# EAGLE design PIR new (EAGLE 9.6.2)
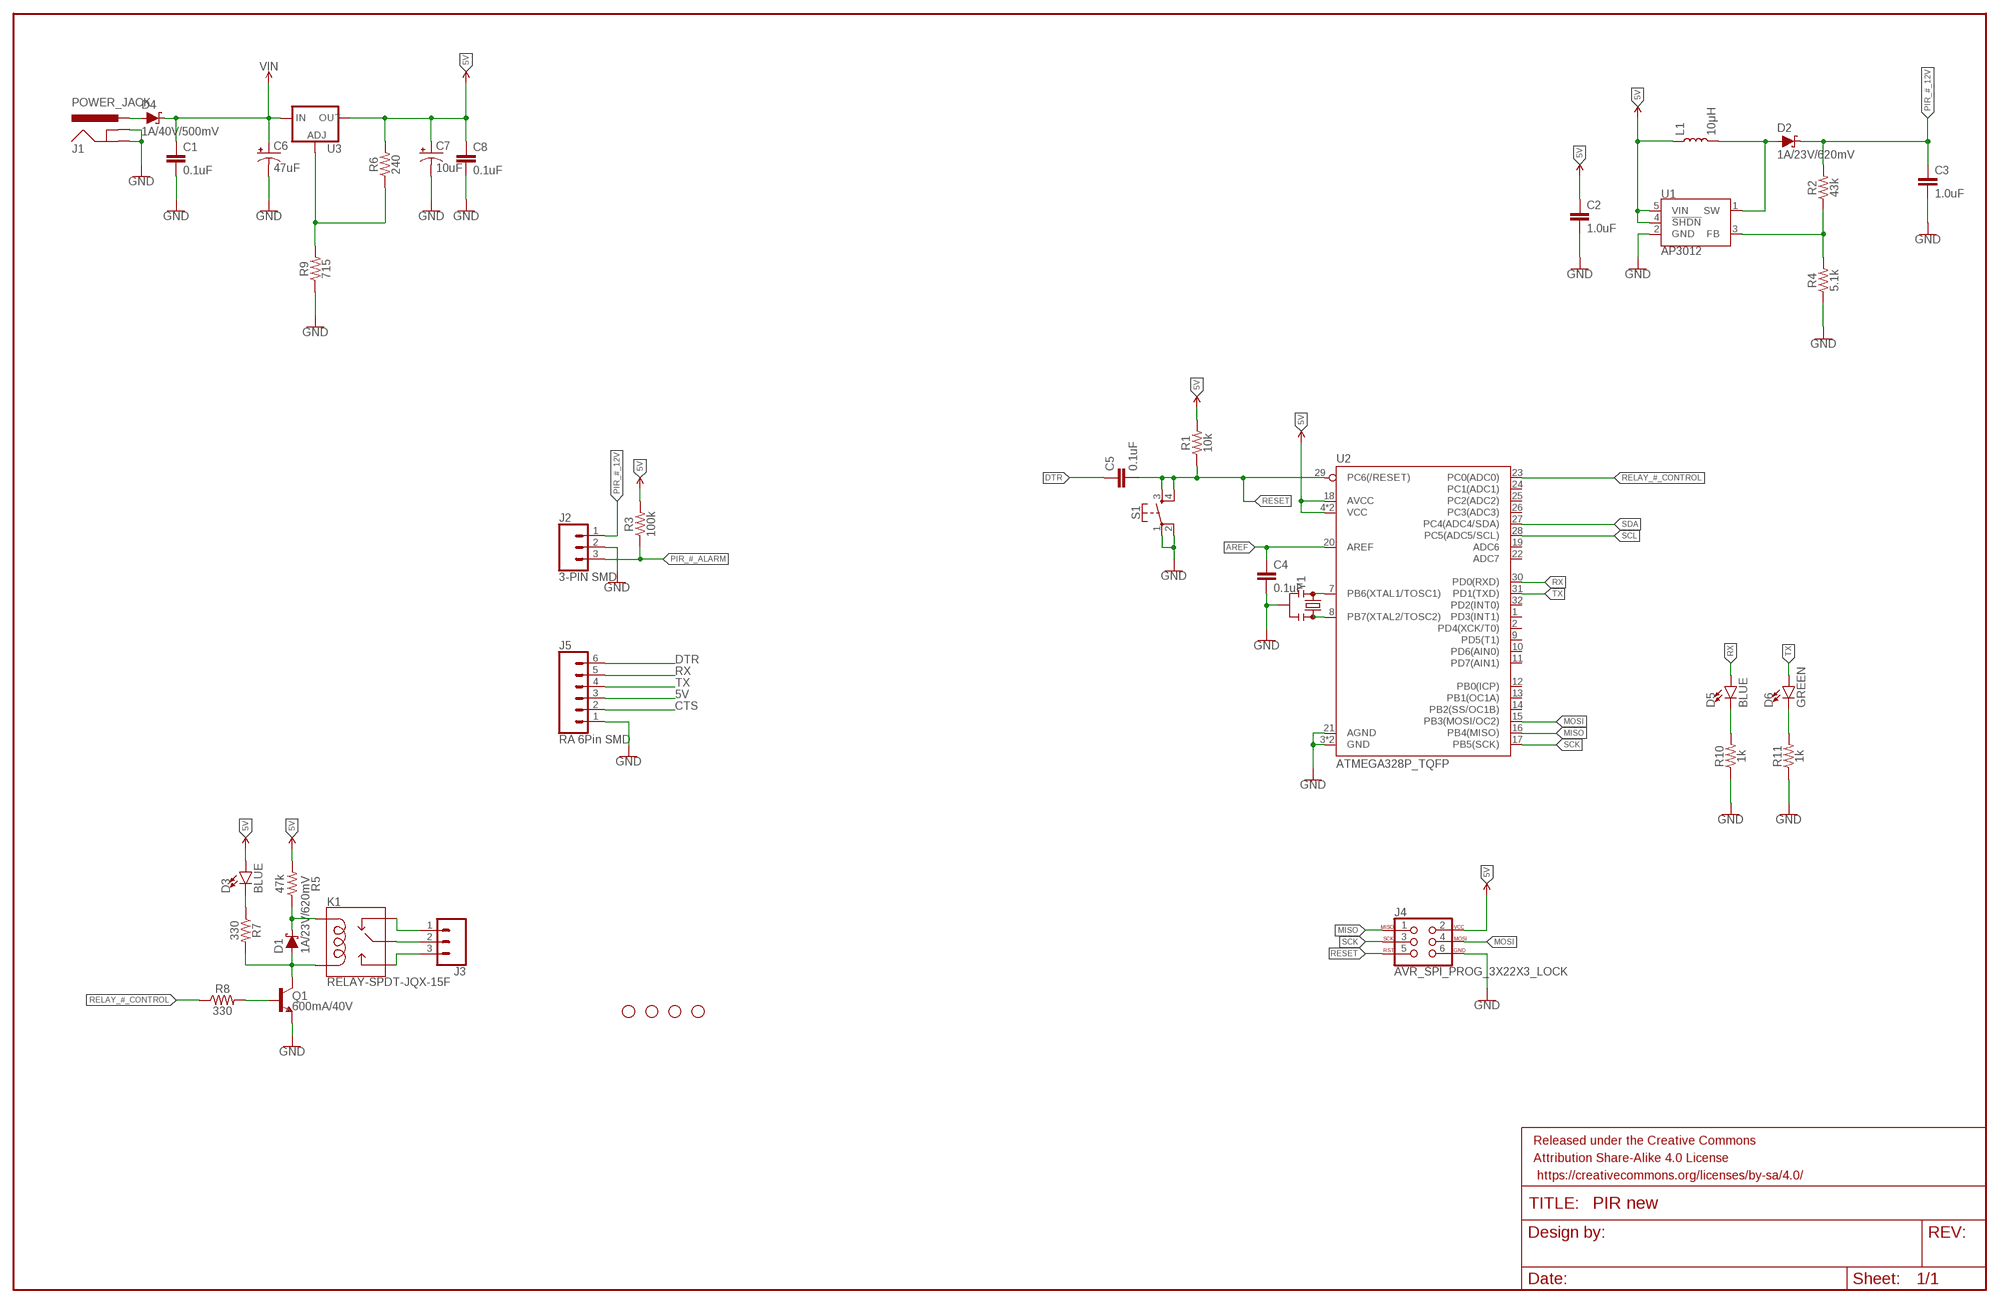
[diagram p0: schematic, sheet 1]

## Parts
C1  0.1uF  0.1UF-0603-25V-5%  [0603]
C2  1.0uF  1.0UF-0603-16V-10%  [0603]
C3  1.0uF  1.0UF-0603-16V-10%  [0603]
C4  0.1uF  0.1UF-0603-25V-(+80/-20%)  [0603]
C5  0.1uF  0.1UF-0603-25V-(+80/-20%)  [0603]
C6  47uF  47UF-POLAR-PANASONIC_D-35V-20%  [PANASONIC_D]
C7  10uF  10UF-POLAR-EIA3216-16V-10%(TANT)  [EIA3216]
C8  0.1uF  0.1UF-0603-25V-(+80/-20%)  [0603]
D1  1A/23V/620mV  DIODE-SCHOTTKY-BAT20J  [SOD-323]
D2  1A/23V/620mV  DIODE-SCHOTTKY-BAT20J  [SOD-323]
D3  BLUE  LED-BLUE0603  [LED-0603]
D4  1A/40V/500mV  DIODE-SCHOTTKY-SS14  [SMA-DIODE]
D5  BLUE  LED-BLUE0603  [LED-0603]
D6  GREEN  LED-GREEN0603  [LED-0603]
FRAME1  FRAME-LEDGER  [CREATIVE_COMMONS]
H1  STAND-OFF  [STAND-OFF]
H2  STAND-OFF  [STAND-OFF]
H3  STAND-OFF  [STAND-OFF]
H4  STAND-OFF  [STAND-OFF]
J1  POWER_JACK  [POWER_JACK_PTH]
J2  3-PIN SMD  CONN_03JST-SMD  [JST-3-SMD]
J3  CONN_03SCREW_LOCK  [SCREWTERMINAL-3.5MM-3_LOCK.007S]
J4  AVR_SPI_PROG_3X22X3_LOCK  [2X3_LOCK]
J5  RA 6Pin SMD  CONN_06SMD  [1X06-SMD_RA_MALE]
K1  RELAY-SPDT-JQX-15F  [RELAY-T90]
L1  10μH  10μH_SHIELDED_INDUCTOR0805  [0805]
Q1  600mA/40V  TRANS_NPN-MMBT2222AL  [SOT23-3]
R1  10k  10KOHM-0603-1/10W-1%  [0603]
R2  43k  43KOHM-0603-1/10W-1%  [0603]
R3  100k  100KOHM-0603-1/10W-1%  [0603]
R4  5.1k  5.1KOHM5.1KOHM-0603-1/10W-1%  [0603]
R5  47k  47KOHM-0603-1/10W-1%  [0603]
R6  240  240OHM-0603-1/10W-1%  [0603]
R7  330  330OHM-0603-1/10W-1%  [0603]
R8  330  330OHM-0603-1/10W-1%  [0603]
R9  715  715OHM-0603-1/10W-1%  [0603]
R10  1k  1KOHM-0603-1/10W-1%  [0603]
R11  1k  1KOHM-0603-1/10W-1%  [0603]
S1  MOMENTARY-SWITCH-SPST-2-SMD-5.2MM-TALL  [TACTILE_SWITCH_SMD_5.2MM]
U1  AP3012  [SOT23-5]
U2  ATMEGA328P_TQFP  [TQFP32-08]
U3  V_REG_LM1117SOT223  [SOT223]
Y1  RESONATORSMD-3.2X1.3  [RESONATOR-SMD-3.2X1.3]

## Nets
5V: C2.1 C7.+ C8.1 D3.A J4.2 J5.3 L1.1 R1.2 R3.2 R5.2 R6.2 U1.4(!SHDN!) U1.5(VIN) U2.4(VCC) U2.6(VCC) U2.18(AVCC) U3.2(OUT) U3.4(OUT) ; supply symbol labelled 3.3V, VCC
AREF: C4.1 U2.20(AREF)
COM: J3.2 K1.MAIN
CTS: J5.2
DTR: C5.1 J5.6
GND: C1.2 C2.2 C3.2 C4.2 C6.- C7.- C8.2 J1.GND J1.GNDBREAK J2.2 J4.6 J5.1 Q1.2(E) R4.1 R9.1 R10.1 R11.1 S1.1 S1.2 U1.2(GND) U2.3(GND) U2.5(GND) U2.21(AGND) Y1.2
MISO: J4.1 U2.16(PB4(MISO))
MOSI: J4.4 U2.15(PB3(MOSI/OC2))
N$1: D2.A L1.2 U1.1(SW)
N$2: D5.C R10.2
N$6: Q1.1(B) R8.2
N$7: D1.A K1.COIL2 Q1.3(C) R7.2
N$8: D1.C K1.COIL1 R5.1
N$9: D3.C R7.1
N$10: U2.7(PB6(XTAL1/TOSC1)) Y1.1
N$11: U2.8(PB7(XTAL2/TOSC2)) Y1.3
N$12: D4.A J1.PWR
N$13: R6.1 R9.2 U3.1(ADJ)
N$14: D6.C R11.2
N$15: R2.1 R4.2 U1.3(FB)
NC: J3.1 K1.NC
NO: J3.3 K1.NO
PIR_#_12V: C3.1 D2.C J2.1 R2.2
PIR_#_ALARM: J2.3 R3.1
RELAY_#_CONTROL: R8.1 U2.23(PC0(ADC0))
RESET: C5.2 J4.5 R1.1 S1.3 S1.4 U2.29(PC6(/RESET))
RX: D5.A J5.5 U2.30(PD0(RXD))
SCK: J4.3 U2.17(PB5(SCK))
SCL: U2.28(PC5(ADC5/SCL))
SDA: U2.27(PC4(ADC4/SDA))
TX: D6.A J5.4 U2.31(PD1(TXD))
VIN: C1.1 C6.+ D4.C U3.3(IN)
Unconnected: U2.1(PD3(INT1)) U2.2(PD4(XCK/T0)) U2.9(PD5(T1)) U2.10(PD6(AIN0)) U2.11(PD7(AIN1)) U2.12(PB0(ICP)) U2.13(PB1(OC1A)) U2.14(PB2(SS/OC1B)) U2.19(ADC6) U2.22(ADC7) U2.24(PC1(ADC1)) U2.25(PC2(ADC2)) U2.26(PC3(ADC3)) U2.32(PD2(INT0))

## Library data of the parts
C1 = SparkFun-Capacitors:0.1UF: 0.1µF ceramic capacitors A capacitor is a passive two-terminal electrical component used to store electrical energy temporarily in an electric field.; PROD_ID: CAP-08604
C2 C3 = SparkFun-Capacitors:1.0UF: 1µF ceramic capacitors A capacitor is a passive two-terminal electrical component used to store electrical energy temporarily in an electric field.; PROD_ID: CAP-00868
C4 C5 C8 = SparkFun-Capacitors:0.1UF: 0.1µF ceramic capacitors A capacitor is a passive two-terminal electrical component used to store electrical energy temporarily in an electric field.; PROD_ID: CAP-00810
C6 = SparkFun-Capacitors:47UF-POLAR: 47µF polarized capacitors A capacitor is a passive two-terminal electrical component used to store electrical energy temporarily in an electric field.; PROD_ID: CAP-08478
C7 = SparkFun-Capacitors:10UF-POLAR: 10.0µF polarized capacitors A capacitor is a passive two-terminal electrical component used to store electrical energy temporarily in an electric field.; PROD_ID: CAP-00811
D1 D2 = SparkFun-DiscreteSemi:DIODE-SCHOTTKY: Schottky diode A Schottky diode is a semiconductor diode which has a low forward voltage drop and a very fast switching action.; PROD_ID: DIO-11623
D3 D5 = SparkFun-LED:LED-BLUE: Blue SMD LED Used in manufacturing of various products at SparkFun Packages: 0603 - SMD 0603 package [Product Link] <http://www.digikey.com/product-detail/en/SMLE12BC7TT86/511-1589-2-ND/1641808> 1206 - SMD1206 package [Product Link] <http://www.digikey.com/product-detail/en/lite-on-inc/LTST-C150TBKT/160-1643-1-ND/573584> SparkFun Products: ESP8266 Thing-Dev Board <https://www.sparkfun.com/products/13711> RedBoard <https://www.sparkfun.com/products/12757>; PROD_ID: DIO-08575
D4 = SparkFun-DiscreteSemi:DIODE-SCHOTTKY: Schottky diode A Schottky diode is a semiconductor diode which has a low forward voltage drop and a very fast switching action.; PROD_ID: DIO-08053
D6 = SparkFun-LED:LED-GREEN: Green SMD LED Used in manufacturing of various products at SparkFun Packages: 0603 - SMD 0603 package [Product Link] <http://www.futureelectronics.com/en/technologies/semiconductors/optoelectronics/leds/Pages/9894312-LTST-C190GKT.aspx?CrossPart=HSMG-C190&IM=0> LilyPad 1206 - SMD1206 LilyPad package [Product Link] <http://www.futureelectronics.com/en/Technologies/Product.aspx?ProductID=IN150NGHARVATEKCORPORATION2049943&IM=0> 1206 - SMD1206 package [Product Link] <http://www.futureelectronics.com/en/technologies/semiconductors/optoelectronics/leds/Pages/8315665-LTST-C150KGKT.aspx?IM=0> 1206 Bottom Mount -SMD 1206 Bottom Mount [Product Link] <http://www.digikey.com/product-detail/en/lite-on-inc/LTST-C230KGKT/160-1456-1-ND/386854> SparkFun Products: Pro Mini 328 -5V <https://www.sparkfun.com/products/821> RedBoard <https://www.sparkfun.com/products/12757> MP3 Trigger <https://www.sparkfun.com/products/13720> Makey Makey <https://www.sparkfun.com/products/11076>; PROD_ID: DIO-00821
FRAME1 = SparkFun-Aesthetics:FRAME-LEDGER: Schematic Frame - Ledger Standard 11x14 US Ledger frame
H1-H4 = SparkFun-Hardware:STAND-OFF: Stand Off Drill holes for mechanically mounting via screws, standoffs, etc. Note: Use the keepout ring to avoid running the screw head into surrounding components. Variant Overviews STAND-OFF - Mechanical footprint for a #4 phillips button head screw. STAND-OFF-TIGHT - Mechanical footprint for a #4 phillips button head screw, Example SparkFun Products Screw - Phillips Head (1/4", 4-40, 10 pack) <https://www.sparkfun.com/products/10453> (PRT-10453) Screw - Phillips Head (1/2", 4-40, 10 pack) <https://www.sparkfun.com/products/10452> (PRT-10452) Screw - Phillips Head (3/4", 4-40, 10 pack) <https://www.sparkfun.com/products/10451> (PRT-10451) Screw - Phillips Head (1", 4-40, 10 pack) <https://www.sparkfun.com/products/10450> (PRT-10450)
J1 = SparkFun-Connectors:POWER_JACK: Power Jack Connector This is the standard 5.5mm barrel jack for power. The PTH is the most common, proven, reliable, footprint. The Slot footprint only works if the mill layer is transmitted to the PCB fab house so be warned. Here are the connectors we sell at SparkFun: DC Barrel Power Jack/Connector <https://www.sparkfun.com/products/119> (PRT-00119) DC Barrel Power Jack/Connector (SMD) <https://www.sparkfun.com/products/12748> (PRT-12748) DC Barrel Jack Adapter - Breadboard Compatible <https://www.sparkfun.com/products/10811> (PRT-10811) It is used on this SparkFun product (and many, many others): SparkFun RedBoard - Programmed with Arduino <https://www.sparkfun.com/products/12757> (DEV-12757) Also, if you need a mating power supply or connector, please check these out: Wall Adapter Power Supply - 9VDC 650mA <https://www.sparkfun.com/products/298> (TOL-00298) DC Barrel Jack Adapter - Male <https://www.sparkfun.com/products/10287> (PRT-10287); PROD_ID: CONN-08197
J2 = SparkFun-Connectors:CONN_03: Multi connection point. Often used as Generic Header-pin footprint for 0.1 inch spaced/style header connections On any of the 0.1 inch spaced packages, you can populate with these: Break Away Headers - Straight <https://www.sparkfun.com/products/116> (PRT-00116) Break Away Male Headers - Right Angle <https://www.sparkfun.com/products/553> (PRT-00553) Female Headers <https://www.sparkfun.com/products/115> (PRT-00115) Break Away Headers - Machine Pin <https://www.sparkfun.com/products/117> (PRT-00117) Break Away Female Headers - Swiss Machine Pin <https://www.sparkfun.com/products/743> (PRT-00743) Stackable Header - 3 Pin (Female, 0.1") <https://www.sparkfun.com/products/13875> (PRT-13875) For SCREWTERMINALS and SPRING TERMINALS visit here: Screw Terimnals on SparkFun.com <https://www.sparkfun.com/search/results?term=Screw+Terminals> (5mm/3.5mm/2.54mm spacing) This device is also useful as a general connection point to wire up your design to another part of your project. Our various solder wires solder well into these plated through hole pads. Hook-Up Wire - Assortment (Stranded, 22 AWG) <https://www.sparkfun.com/products/11375> (PRT-11375) Hook-Up Wire - Assortment (Solid Core, 22 AWG) <https://www.sparkfun.com/products/11367> (PRT-11367) View the entire wire category on our website here <https://www.sparkfun.com/categories/141> Special notes: Molex polarized connector foot print use with SKU : PRT-08232 with associated crimp pins and housings.; PROD_ID: CONN-12591
J3 = SparkFun-Connectors:CONN_03: Multi connection point. Often used as Generic Header-pin footprint for 0.1 inch spaced/style header connections On any of the 0.1 inch spaced packages, you can populate with these: Break Away Headers - Straight <https://www.sparkfun.com/products/116> (PRT-00116) Break Away Male Headers - Right Angle <https://www.sparkfun.com/products/553> (PRT-00553) Female Headers <https://www.sparkfun.com/products/115> (PRT-00115) Break Away Headers - Machine Pin <https://www.sparkfun.com/products/117> (PRT-00117) Break Away Female Headers - Swiss Machine Pin <https://www.sparkfun.com/products/743> (PRT-00743) Stackable Header - 3 Pin (Female, 0.1") <https://www.sparkfun.com/products/13875> (PRT-13875) For SCREWTERMINALS and SPRING TERMINALS visit here: Screw Terimnals on SparkFun.com <https://www.sparkfun.com/search/results?term=Screw+Terminals> (5mm/3.5mm/2.54mm spacing) This device is also useful as a general connection point to wire up your design to another part of your project. Our various solder wires solder well into these plated through hole pads. Hook-Up Wire - Assortment (Stranded, 22 AWG) <https://www.sparkfun.com/products/11375> (PRT-11375) Hook-Up Wire - Assortment (Solid Core, 22 AWG) <https://www.sparkfun.com/products/11367> (PRT-11367) View the entire wire category on our website here <https://www.sparkfun.com/categories/141> Special notes: Molex polarized connector foot print use with SKU : PRT-08232 with associated crimp pins and housings.; PROD_ID: CONN-08288; SF_ID: PRT-08235
J4 = SparkFun-Connectors:AVR_SPI_PROG_3X2: AVR ISP 6 Pin This is the reduced ISP connector for AVR programming. Common on Arduino. This footprint will take up less PCB space and can be used with a 10-pin to 6-pin adapter such as SKU: BOB-08508 **Special note about "TEST_POINT" package. The stop mask is on the top side, so if you want your programming test points to be on the bottom of your board, make sure to place this package on the bottom side of the board. This also ensure that the orientation to program from the bottom side will be correct. SparkFun Products: SparkFun ISP Pogo Adapter <https://www.sparkfun.com/products/11591> - NS Tiny AVR Programmer <https://www.sparkfun.com/products/11801> -PTH
J5 = SparkFun-Connectors:CONN_06: Multi connection point. Often used as Generic Header-pin footprint for 0.1 inch spaced/style header connections On any of the 0.1 inch spaced packages, you can populate with these: Break Away Headers - Straight <https://www.sparkfun.com/products/116> (PRT-00116) Break Away Male Headers - Right Angle <https://www.sparkfun.com/products/553> (PRT-00553) Female Headers <https://www.sparkfun.com/products/115> (PRT-00115) Break Away Headers - Machine Pin <https://www.sparkfun.com/products/117> (PRT-00117) Break Away Female Headers - Swiss Machine Pin <https://www.sparkfun.com/products/743> (PRT-00743) Arduino Stackable Header - 6 Pin <https://www.sparkfun.com/products/9280> (PRT-09280) For SCREWTERMINALS and SPRING TERMINALS visit here: Screw Terimnals on SparkFun.com <https://www.sparkfun.com/search/results?term=Screw+Terminals> (5mm/3.5mm/2.54mm spacing) This device is also useful as a general connection point to wire up your design to another part of your project. Our various solder wires solder well into these plated through hole pads. Hook-Up Wire - Assortment (Stranded, 22 AWG) <https://www.sparkfun.com/products/11375> (PRT-11375) Hook-Up Wire - Assortment (Solid Core, 22 AWG) <https://www.sparkfun.com/products/11367> (PRT-11367) View the entire wire category on our website here <https://www.sparkfun.com/categories/141>; PROD_ID: CONN-08971
K1 = SparkFun-Electromechanical:RELAY-SPDT: SPDT Electromechanical Relay Single-pole, double-throw sealed relays. When current is applied to the coil, it throws a simple changeover switch, terminating the connection from the NC contact to ground and closing the NO contact. Use them to switch high voltage/high current devices. SparkFun Products JQX-15F: Relay SPDT Sealed - 20A <https://www.sparkfun.com/products/10924> (COM-10924) JZC-11F: Relay SPDT Sealed <https://www.sparkfun.com/products/100> (COM-00100); PROD_ID: COMP-10736; SF_SKU: COM-10924
L1 = SparkFun-Coils:10μH_SHIELDED_INDUCTOR: Murata 10uH Inductor 10uH 60mA 400mOhm 0805 Package Shielded; PROD_ID: NDUC-13231
Q1 = SparkFun-DiscreteSemi:TRANS_NPN: NPN transistor Current controlled devices typically used to amplify current or used as a switch. BC547 - COM-08928 <http://www.sparkfun.com/products/8928> (TO-92 45V 100mA) (1.Collector 2.Base 3.Emitter) 2N3904 - COM-00521 <http://www.sparkfun.com/products/521> (TO-92 40V 200mA) (1.Emitter 2.Base 3.Collector) P2N2222A - COM-12852 <http://www.sparkfun.com/products/12852> (TO-92 40V 600mA) (1.Collector 2.Base 3.Emitter); PROD_ID: TRANS-08049
R1 = SparkFun-Resistors:10KOHM: 10kΩ resistor A resistor is a passive two-terminal electrical component that implements electrical resistance as a circuit element. Resistors act to reduce current flow, and, at the same time, act to lower voltage levels within circuits. - Wikipedia; PROD_ID: RES-00824
R2 = SparkFun-Resistors:43KOHM: 43kΩ resistor A resistor is a passive two-terminal electrical component that implements electrical resistance as a circuit element. Resistors act to reduce current flow, and, at the same time, act to lower voltage levels within circuits. - Wikipedia; PROD_ID: RES-07858
R3 = SparkFun-Resistors:100KOHM: 100kΩ resistor A resistor is a passive two-terminal electrical component that implements electrical resistance as a circuit element. Resistors act to reduce current flow, and, at the same time, act to lower voltage levels within circuits. - Wikipedia; PROD_ID: RES-07828
R4 = SparkFun-Resistors:5.1KOHM; PROD_ID: RES-12083
R5 = SparkFun-Resistors:47KOHM: 47kΩ resistor A resistor is a passive two-terminal electrical component that implements electrical resistance as a circuit element. Resistors act to reduce current flow, and, at the same time, act to lower voltage levels within circuits. - Wikipedia; PROD_ID: RES-07871
R6 = SparkFun-Resistors:240OHM: 240Ω resistor A resistor is a passive two-terminal electrical component that implements electrical resistance as a circuit element. Resistors act to reduce current flow, and, at the same time, act to lower voltage levels within circuits. - Wikipedia; PROD_ID: RES-07849
R7 R8 = SparkFun-Resistors:330OHM: 330Ω resistor A resistor is a passive two-terminal electrical component that implements electrical resistance as a circuit element. Resistors act to reduce current flow, and, at the same time, act to lower voltage levels within circuits. - Wikipedia; PROD_ID: RES-00818
R9 = SparkFun-Resistors:715OHM: 715Ω resistor A resistor is a passive two-terminal electrical component that implements electrical resistance as a circuit element. Resistors act to reduce current flow, and, at the same time, act to lower voltage levels within circuits. - Wikipedia; PROD_ID: RES-07850
R10 R11 = SparkFun-Resistors:1KOHM: 1kΩ resistor A resistor is a passive two-terminal electrical component that implements electrical resistance as a circuit element. Resistors act to reduce current flow, and, at the same time, act to lower voltage levels within circuits. - Wikipedia; PROD_ID: RES-07856
S1 = SparkFun-Switches:MOMENTARY-SWITCH-SPST-2: Momentary Switch (Pushbutton) - SPST - Two Circuits Normally-open (NO) SPST momentary switches (buttons, pushbuttons). Schematic symbol includes two switch circuits. Variants SMD-4.6MMX2.8MM - 4.60mm x 2.80mm Tactile Momentary Button Switch - Used on SparkFun SAMD21 Mini Breakout <https://www.sparkfun.com/products/13664> SMD-5.2MM - Mini Pushbutton Switch - SMD <https://www.sparkfun.com/products/8720> - Used on Arduino Pro Mini <https://www.sparkfun.com/products/11114>; PROD_ID: SWCH-14139
U1 = SparkFun-IC-Power:AP3012: AP3012 The AP3012 is a high power, constant frequency, current mode PWM, inductor based, step-up (boost) converter. The converter operates at high frequency (1.5MHz) so that a small, low profile inductor can be used. Datasheet <https://www.diodes.com/assets/Datasheets/AP3012.pdf>; PROD_ID: VREG-13911
U2 = SparkFun-IC-Microcontroller:ATMEGA328P_TQFP: Popular 328P in QFP Storefront component: ATmega328 - TQFP <https://www.sparkfun.com/products/13448> (COM-13448) Datasheet <http://www.sparkfun.com/datasheets/Components/SMD/ATMega328.pdf> SparkFun Products SparkFun RedBoard - Programmed with Arduino <https://www.sparkfun.com/products/12757> (DEV-12757) Arduino Pro Mini 328 - 5V/16MHz <https://www.sparkfun.com/products/11113> (DEV-11113) Arduino Pro Mini 328 - 3.3V/8MHz <https://www.sparkfun.com/products/11114> (DEV-11114) SparkFun OpenLog <https://www.sparkfun.com/products/13712> (DEV-13712) SparkFun MicroView - OLED Arduino Module <https://www.sparkfun.com/products/12923> (DEV-12923) SparkFun Digital Sandbox <https://www.sparkfun.com/products/12651> (DEV-12651) SparkFun PicoBoard <https://www.sparkfun.com/products/11888> (WIG-11888) Arduino Fio <https://www.sparkfun.com/products/10116> (DEV-10116) LilyPad Arduino 328 Main Board <https://www.sparkfun.com/products/13342> (DEV-13342) SparkFun RedStick <https://www.sparkfun.com/products/13741> (DEV-13741) LilyPad MP3 <https://www.sparkfun.com/products/11013> (DEV-11013) LilyPad Arduino SimpleSnap <https://www.sparkfun.com/products/10941> (DEV-10941) SparkFun Stepoko <https://www.sparkfun.com/products/13899> (ROB-13899) SparkFun Geiger Counter <https://www.sparkfun.com/products/11345> (SEN-11345) SparkFun EL Sequencer <https://www.sparkfun.com/products/12781> (COM-12781) Arduino Pro 328 - 5V/16MHz <https://www.sparkfun.com/products/10915> (DEV-10915) CryptoCape <https://www.sparkfun.com/products/12773> (DEV-12773) SparkFun IR Thermometer Evaluation Board - MLX90614 <https://www.sparkfun.com/products/10740> (SEN-10740) SparkFun RedBot Mainboard <https://www.sparkfun.com/products/12097> (ROB-12097) Arduino Pro 328 - 3.3V/8MHz <https://www.sparkfun.com/products/10914> (DEV-10914) SparkFun Block for Intel® Edison - Arduino <https://www.sparkfun.com/products/13036> (DEV-13036) SparkFun Simon Says - Surface Mount Soldering Kit <https://www.sparkfun.com/products/10935> (KIT-10935) SparkFun 7-Segment Serial Display - Red <https://www.sparkfun.com/products/11441> (COM-11441) SparkFun 7-Segment Serial Display - White <https://www.sparkfun.com/products/11629> (COM-11629) SparkFun 7-Segment Serial Display - Yellow <https://www.sparkfun.com/products/11443> (COM-11443) SparkFun 7-Segment Serial Display - Kelly Green <https://www.sparkfun.com/products/11440> (COM-11440) SparkFun 7-Segment Serial Display - Blue <https://www.sparkfun.com/products/11442> (COM-11442) SparkFun OpenSegment Serial Display - 20mm (Blue) <https://www.sparkfun.com/products/11647> (COM-11647) SparkFun OpenSegment Serial Display - 20mm (Green) <https://www.sparkfun.com/products/11646> (COM-11646) SparkFun OpenSegment Serial Display - 20mm (White) <https://www.sparkfun.com/products/11648> (COM-11648) SparkFun OpenSegment Serial Display - 20mm (Red) <https://www.sparkfun.com/products/11644> (COM-11644) SparkFun OpenSegment Serial Display - 20mm (Yellow) <https://www.sparkfun.com/products/11645> (COM-11645) SparkFun OpenSegment Shield <https://www.sparkfun.com/products/13190> (DEV-13190); PROD_ID: IC-09069
U3 = SparkFun-IC-Power:V_REG_LM1117: Voltage Regulator LM1117 Standard adjustable voltage regulator but in SMD form. Spark Fun Electronics SKU : COM-00595; PROD_ID: VREG-08170
Y1 = SparkFun-Clocks:RESONATOR: Resonators (Generic) Ceramic resonators are clock-generating components, often used to control timing in microcontrollers. They usually have 3 pins: two pins for oscillation, and one pin for ground. Compared to crystals, resonators have worse tolerance, but are usually much cheaper. Plus, they have built-in load capacitors! These devices are used on boards like the Arduino Pro 8MHz <https://www.sparkfun.com/products/11114> and Arduino Pro 16MHz <https://www.sparkfun.com/products/11113>.

## Board
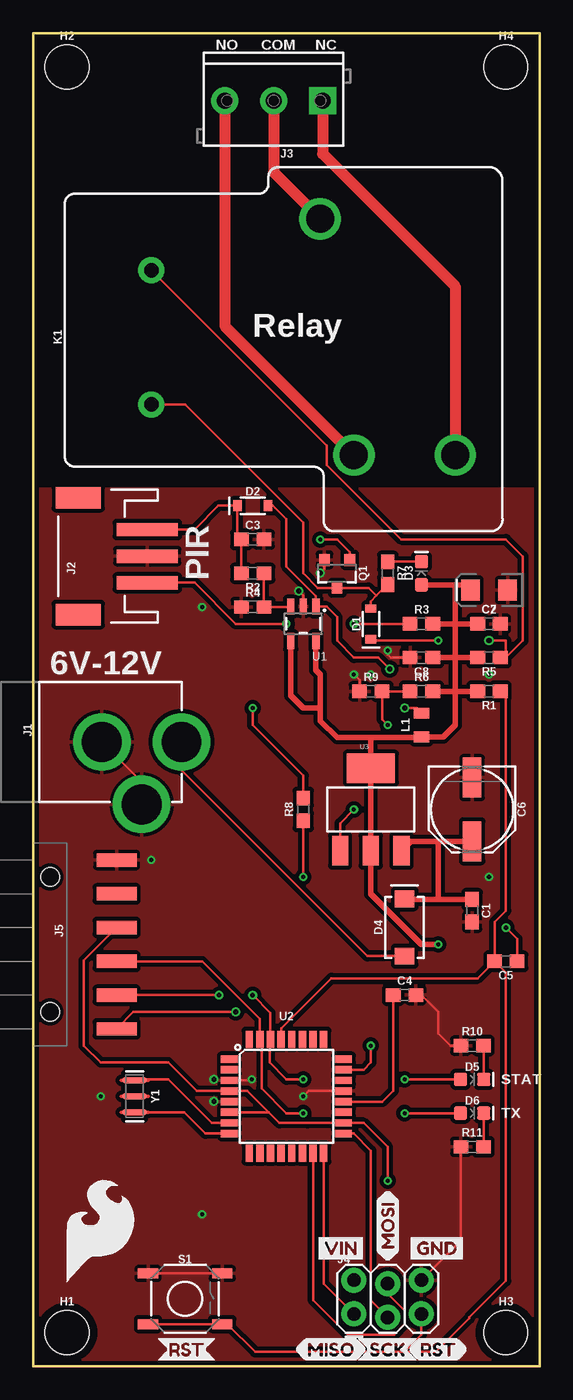
[diagram p1: board, top side]
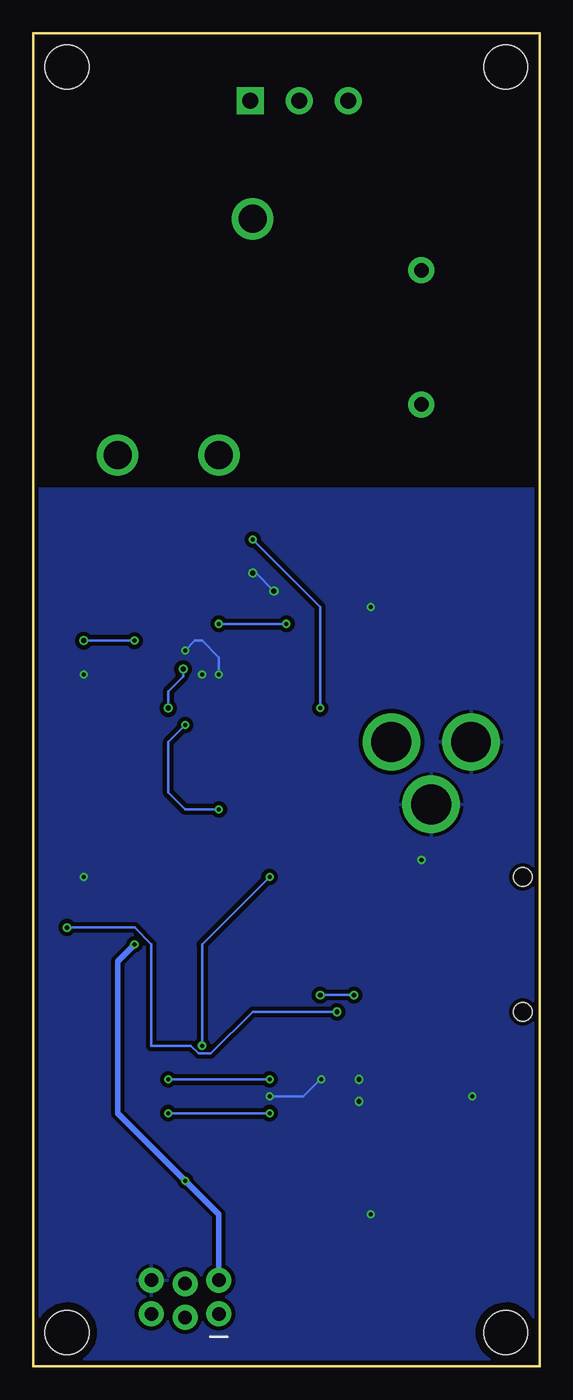
[diagram p2: board, bottom side, seen from below]

Size 38.1 x 100.33 mm. Coordinates in mm from the lower left corner, seen from the top.
Outline: 0,0 38.1,0 38.1,100.33 0,100.33 0,0
Copper layers (1*16): Top 0.035mm / dielectric 1.5mm / Bottom 0.035mm
Design rules "SparkFun-2-layer-ALC": minimum track width 7mil, minimum drill 0.3mm, track to track 8mil, track to pad 8mil, pad to pad 7mil, via to via 8mil, smd to smd 7mil, copper to edge 8mil, drill to drill 8mil, minimum pad ring 6mil, minimum via ring 6mil, stop-mask expansion 4mil, vias tented up to drill 25mil, thermal gap 10mil

### Footprints (pad centres in the part's own frame; a part is rotated, then mirrored left to right if it is on the bottom)
0603 = smd 1.1 x 1: 1 -0.85,0; 2 0.85,0
PANASONIC_D = smd 3 x 1.4: + 2.4,0; - -2.4,0
EIA3216 = smd 1.4 x 1.6: + 1.4,0; - -1.4,0
SOD-323 = smd 0.63 x 0.83: A 1.15,0; C -1.15,0
LED-0603 = smd 1 x 1: A -0.877,0; C 0.877,0
SMA-DIODE = smd 1.27 x 1.47: A -2.15,0; C 2.15,0
STAND-OFF = hole 3.302: 0,0
POWER_JACK_PTH = drill 2.997 pad 4.318: GND 0,7.7; GNDBREAK 4.7,10.7; PWR 0,13.7
JST-3-SMD = smd 1 x 4.6: 1 2.01,-4.77; 2 0.01,-4.77; 3 -1.99,-4.77 | smd 1.6 x 3.4: NC1 -4.39,0.43; NC2 4.41,0.43
SCREWTERMINAL-3.5MM-3_LOCK.007S = drill 1.2 pad 2.032 square: 1 -0.178,0 | drill 1.2 pad 2.032: 2 3.5,0; 3 7.178,0
2X3_LOCK = drill 1.016 pad 1.88: 1 0,0.127; 2 0,2.667; 3 2.54,-0.127; 4 2.54,2.413; 5 5.08,0.127; 6 5.08,2.667
1X06-SMD_RA_MALE = smd 1 x 3: 1 -6.35,5; 2 -3.81,5; 3 -1.27,5; 4 1.27,5; 5 3.81,5; 6 6.35,5 | hole 1.4: -5.08,0; 5.08,0
RELAY-T90 = drill 1.1 pad 1.956: COIL1 0,-13.9; COIL2 0,-3.81 | drill 2.1: MAIN -12.7,-17.78; NC -22.86,0; NO -15.24,0
0805 = smd 0.8 x 1.2: 1 -0.9,0; 2 0.9,0
SOT23-3 = smd 0.8 x 0.9: 1 -0.95,-1; 2 0.95,-1; 3 0,1.1
TACTILE_SWITCH_SMD_5.2MM = smd 1.524 x 0.762: 1 -2.794,1.905; 2 2.794,1.905; 3 -2.794,-1.905; 4 2.794,-1.905
SOT23-5 = smd 0.55 x 1.2: 1 -0.95,-1.3; 2 0,-1.3; 3 0.95,-1.3; 4 0.95,1.3; 5 -0.95,1.3
TQFP32-08 = smd 1.27 x 0.559: 1 -4.293,2.8; 2 -4.293,2; 3 -4.293,1.2; 4 -4.293,0.4; 5 -4.293,-0.4; 6 -4.293,-1.2; 7 -4.293,-2; 8 -4.293,-2.8; 17 4.293,-2.8; 18 4.293,-2; 19 4.293,-1.2; 20 4.293,-0.4; 21 4.293,0.4; 22 4.293,1.2; 23 4.293,2; 24 4.293,2.8 | smd 0.559 x 1.27: 9 -2.8,-4.293; 10 -2,-4.293; 11 -1.2,-4.293; 12 -0.4,-4.293; 13 0.4,-4.293; 14 1.2,-4.293; 15 2,-4.293; 16 2.8,-4.293; 25 2.8,4.293; 26 2,4.293; 27 1.2,4.293; 28 0.4,4.293; 29 -0.4,4.293; 30 -1.2,4.293; 31 -2,4.293; 32 -2.8,4.293
SOT223 = smd 1.219 x 2.235: 1 -2.311,-3.099; 2 0,-3.099; 3 2.311,-3.099 | smd 3.6 x 2.2: 4 0,3.099
RESONATOR-SMD-3.2X1.3 = smd 0.45 x 1.905: 1 -1.2,0; 2 0,0; 3 1.2,0

### Placement (x,y rotation side)
C1  33.02,34.29 270 top
C2  34.29,55.88 0 top
C3  16.51,62.23 0 top
C4  27.94,27.94 0 top
C5  35.56,30.48 180 top
C6  33.02,41.91 270 top
C7  34.29,58.42 180 top
C8  29.21,53.34 180 top
D1  25.4,55.88 90 top
D2  16.51,64.77 0 top
D3  29.21,59.69 90 top
D4  27.94,33.02 90 top
D5  33.02,21.59 0 top
D6  33.02,19.05 0 top
FRAME1  -80.01,40.64 0 top  (outside the outline)
H1  2.54,2.54 0 top
H2  2.54,97.79 0 top
H3  35.56,2.54 0 top
H4  35.56,97.79 0 top
J1  -2.54,46.99 270 top
J2  3.81,60.96 90 top
J3  21.59,95.25 180 top
J4  24.13,3.81 0 top
J5  1.27,31.75 270 top
K1  8.89,68.58 180 top
L1  29.21,48.26 90 top
Q1  22.86,59.69 180 top
R1  34.29,50.8 180 top
R2  16.51,59.69 180 top
R3  29.21,55.88 0 top
R4  16.51,57.15 0 top
R5  34.29,53.34 180 top
R6  29.21,50.8 0 top
R7  26.67,59.69 270 top
R8  20.32,41.91 90 top
R9  25.4,50.8 0 top
R10  33.02,24.13 0 top
R11  33.02,16.51 0 top
S1  11.43,5.08 0 top
U1  20.32,55.88 180 top
U2  19.05,20.32 0 top
U3  25.4,41.91 0 top
U$1  [MISO_I]  19.68,1.27 0 top
U$2  [MOSI_I]  26.67,7.87 90 top
U$3  [RST_I]  28.19,1.27 0 top
U$4  [SCK_O]  24.38,1.27 0 top
U$5  [GND_P]  27.94,8.89 0 top
U$6  [VIN_P]  20.95,8.89 0 top
U$7  [RST_O]  9.27,1.27 0 top
U$9  [SFE_LOGO_FLAME_.3]  5.08,10.16 0 top
Y1  7.62,20.32 270 top

### Tracks (layer width: path | path; a pad name or v marks a point on that pad's centre or on a via)
5V  (via drill 0.3)
  Top 0.178: J5.3 3.81,30.56 3.81,24.13 5.08,22.86 10.16,22.86 12.3,20.72 U2.4
  Top 0.203: C7.+ 32.5,58.81 | v26.67,13.97 26.67,16.51 24.86,18.32 U2.18 20.63,18.32 20.62,18.32 18.51,18.32 17.71,19.12 | 17.71,19.12 U2.6 | U2.4 16.11,20.72 17.71,19.12
  Top 0.406: 31.75,55.88 R3.2 | 32.5,58.81 31.75,58.81 | 31.75,58.81 D3.A | 31.75,53.34 C8.1 | 31.75,50.8 R6.2 | 31.75,50.8 31.75,53.34 | 31.75,55.88 31.75,53.34 | 25.4,47.31 29.16,47.31 L1.1 30.85,47.36 31.75,48.26 31.75,50.8 | 25.4,47.31 22.86,47.31 21.59,48.58 21.59,49.53 | 25.4,47.31 U3.4 U3.2 25.4,35.56 29.21,31.75 v30.48,31.75 | 31.75,55.88 31.75,58.81 | 31.75,53.34 R5.2 | R1.2 31.75,50.8 | U1.5 21.27,52.39 21.59,52.07 21.59,49.53 | U1.4 19.37,50.48 20.32,49.53 21.59,49.53 | C2.1 31.75,55.88
  Bottom 0.406: v30.48,31.75 31.75,30.48 31.75,19.05 v26.67,13.97 24.13,11.43 J4.2
AREF
  Top 0.203: C4.1 27.09,20.74 26.27,19.92 U2.20
COM
  Top 0.813: J3.2 18.09,89.86 K1.MAIN
DTR  (via drill 0.35)
  Top 0.178: J5.6 7.54,26.67 v15.24,26.67 | v35.56,33.02 36.41,32.17 C5.1
  Bottom 0.178: v15.24,26.67 21.59,26.67 24.73,23.53 25.65,23.53 26.24,24.13 29.21,24.13 29.21,31.75 30.48,33.02 v35.56,33.02
GND  (via drill 0.3, 0.35, 0.38)
  Top 0.203: J4.6 32.17,9.44 R11.1 | S1.1 S1.2 | R10.1 31.41,24.13 30.48,25.06 30.48,26.67 29.21,27.94 C4.2 | J1.GND 8.16,43.99 J1.GNDBREAK | C8.2 26.91,53.34 26.67,53.58 v26.67,53.88 | v24.13,52.07 24.55,51.65 R9.1 | U2.21 20.72,20.72 v20.32,20.32 | v16.44,21.59 16.37,21.52 U2.3 | Q1.2 21.91,60.01 v21.59,59.69 | v19.99,58.34 20.32,58.01 U1.2
  Bottom 0.203: v26.67,53.88 25.94,54.61 25.4,54.61 24.13,53.34 v24.13,52.07 | v20.32,20.32 17.78,20.32 16.51,21.59 v16.44,21.59 | v21.59,59.69 21.34,59.69 v19.99,58.34
  other vias: 12.7,57.15 5.08,20.32 8.89,38.1 12.7,11.43 34.29,36.83 34.29,52.07 25.4,52.07 13.59,19.94 13.59,21.59
  pour Top (isolate 0.305): 0,66.04 0,0 38.1,0 38.1,66.04
  pour Bottom (isolate 0.305): 0,66.04 0,0 38.1,0 38.1,66.04
MISO
  Top 0.203: J4.1 21.85,6.22 U2.16
MOSI
  Top 0.203: U2.15 21.05,4.98 23.65,2.39 27.15,2.39 27.96,3.2 27.96,4.17 26.67,5.46 J4.4
N$1  (via drill 0.38)
  Top 0.203: D2.A 18.03,64.77 19.05,63.75 19.05,60.2 21.27,57.98 U1.1 22.07,57.18 22.86,56.39 22.86,54.61 24.13,53.34 25.97,53.34 v26.83,52.48 | v27.94,49.53 28.84,49.53 L1.2
  Bottom 0.203: v26.83,52.48 26.83,51.91 27.94,50.8 v27.94,49.53
N$2
  Top 0.203: D5.C 33.9,24.1 R10.2
N$6  (via drill 0.3)
  Top 0.203: R8.2 20.32,44.45 16.51,48.26 v16.51,49.53 | v21.59,62.23 22.86,62.23 23.81,61.28 Q1.1
  Bottom 0.203: v16.51,49.53 16.51,57.15 v21.59,62.23
N$7
  Top 0.203: K1.COIL2 11.43,72.39 20.32,63.5 20.32,59.69 21.42,58.59 Q1.3 25.23,58.59 25.82,57.99 | D1.A 25.4,57.57 25.82,57.99 | 25.82,57.99 R7.2
N$8  (via drill 0.3, 0.38)
  Top 0.203: K1.COIL1 22.09,69.28 22.09,67.84 27.7,62.23 35.56,62.23 36.83,60.96 36.83,54.61 35.56,53.34 | v30.48,54.61 25.52,54.61 D1.C | v34.29,54.61 35.56,54.61 35.56,53.76 R5.1
  Top 0.254: 35.56,53.34 R5.1
  Bottom 0.203: v30.48,54.61 v34.29,54.61
N$9
  Top 0.203: R7.1 26.7,60.57 D3.C
N$10
  Top 0.203: U2.7 13.43,18.32 10.16,21.59 7.69,21.59 Y1.1
N$11
  Top 0.203: U2.8 12.96,17.52 11.36,19.12 Y1.3
N$12
  Top 0.203: D4.A 25.15,30.87 11.16,44.86 J1.PWR
N$13  (via drill 0.3)
  Top 0.203: U3.1 23.09,40.87 v24.13,41.91 | v26.67,48.26 26.25,48.68 R9.2 R6.1
  Bottom 0.203: v24.13,41.91 26.67,41.91 27.94,43.18 27.94,46.99 v26.67,48.26
N$14
  Top 0.203: R11.2 33.9,16.54 D6.C
N$15
  Top 0.203: R2.1 R4.2 19.34,57.15 U1.3
NC
  Top 0.813: J3.1 21.77,91.26 31.75,81.28 K1.NC
NO
  Top 0.813: J3.3 14.41,78.3 K1.NO
PIR_#_12V
  Top 0.203: J2.1 12.14,62.97 13.94,64.77 D2.C 15.36,62.53 C3.1 R2.2
PIR_#_ALARM  (via drill 0.3)
  Top 0.203: J2.3 12.14,58.97 15.23,55.88 v19.05,55.88 | R3.1 v24.13,55.88
  Bottom 0.203: v24.13,55.88 v19.05,55.88
RELAY_#_CONTROL  (via drill 0.3)
  Top 0.203: R8.1 v20.32,36.83 | v25.4,24.13 25.4,22.86 24.86,22.32 U2.23
  Bottom 0.203: v20.32,36.83 25.4,31.75 v25.4,24.13
RESET
  Top 0.203: J4.5 29.21,2.36 27.94,1.09 | 27.94,1.09 16.69,1.09 14.61,3.17 S1.4 S1.3 | U2.29 18.65,25.43 22.43,29.21 33.44,29.21 C5.2 | C5.2 34.71,33.44 35.56,34.29 35.56,50.38 R1.1 | 27.94,1.09 30.3,1.09 32.82,3.61 32.82,3.68 35.56,6.42 35.56,29.63 C5.2
RX  (via drill 0.3, 0.35)
  Top 0.178: J5.5 v13.97,27.94 | v16.51,27.94 17.85,26.6 U2.30
  Top 0.203: D5.A v27.94,21.59 | v20.32,21.59 19.05,21.59 17.78,22.86 17.78,24.54 U2.30
  Bottom 0.178: v13.97,27.94 v16.51,27.94
  Bottom 0.203: v27.94,21.59 v20.32,21.59
SCK
  Top 0.203: U2.17 24.11,17.52 25.4,16.23 25.4,4.95 J4.3
TX  (via drill 0.3)
  Top 0.178: J5.4 12.7,30.48 17.05,26.13 U2.31
  Top 0.203: D6.A v27.94,19.05 | U2.31 17.18,24.49 17.18,20.92 19.05,19.05 v20.32,19.05
  Bottom 0.203: v27.94,19.05 v20.32,19.05
VIN
  Top 0.406: D4.C 27.97,35.14 30.48,35.14 | 30.48,35.14 C1.1 | U3.3 28.41,39.51 30.48,39.51 | 30.48,39.51 C6.+ | 30.48,39.51 30.48,35.14

### Text on the board
tPlace: NO | COM | NC | Relay | PIR | 6V-12V | STAT | TX